# Altium schematic sheet USBBridge.SchDoc
size A4
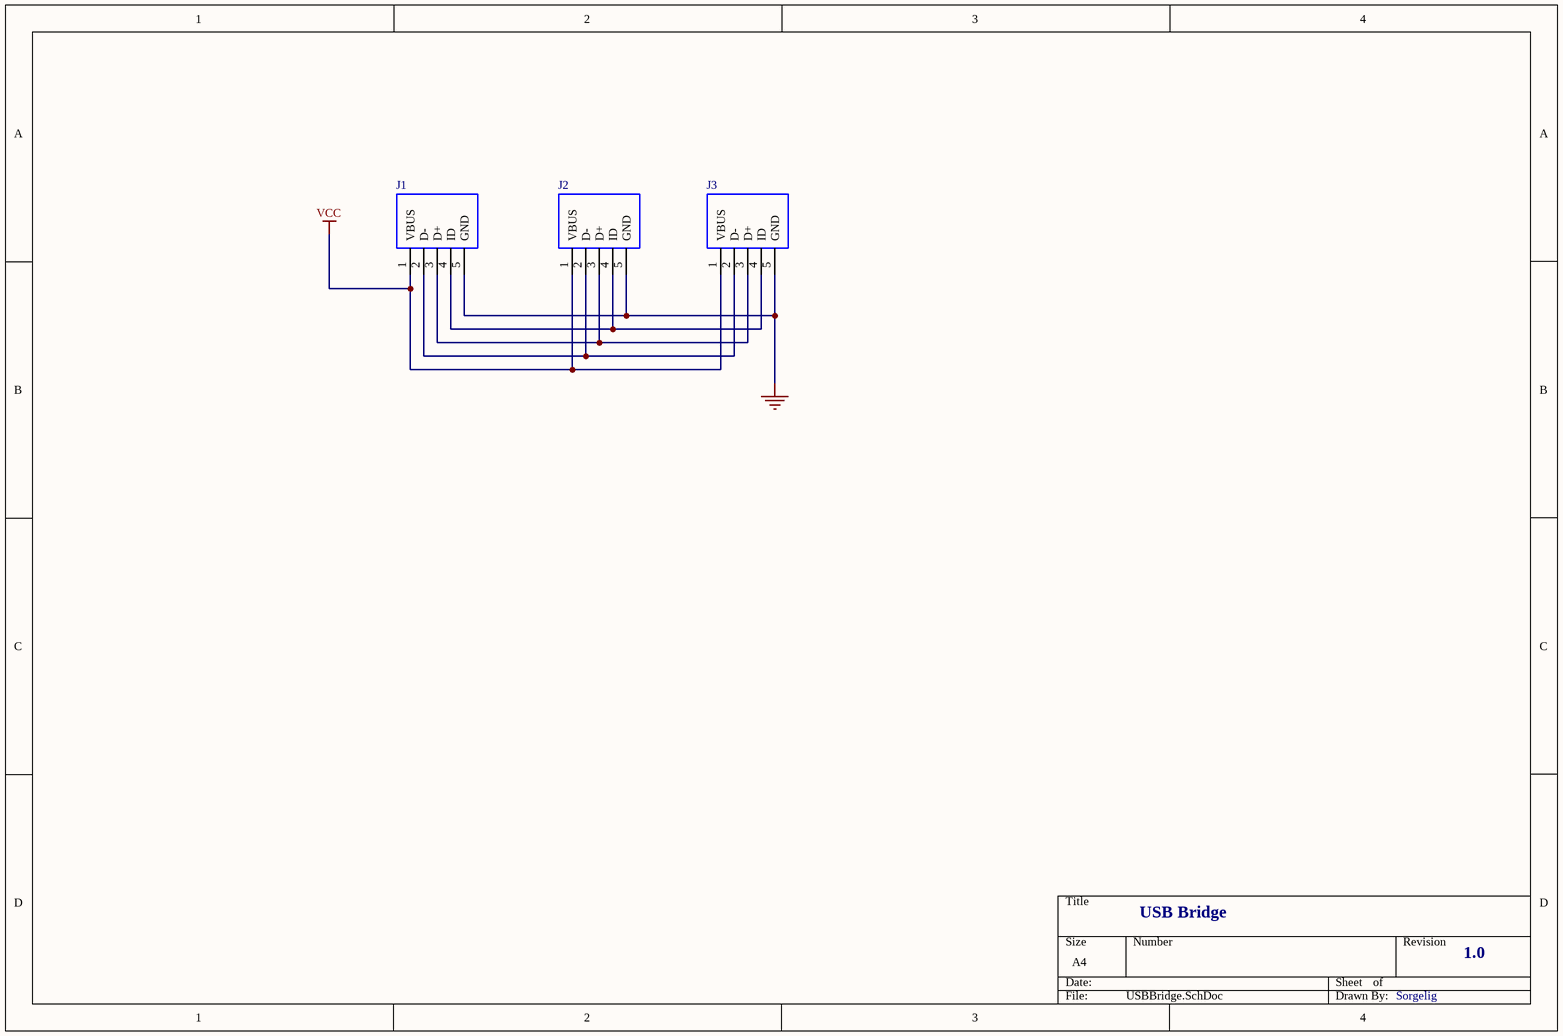
[diagram p0: USBBridge.SchDoc]

## Parts
J1  MicroUSB THT  [MicroUSB THT]  (value not drawn)
J2  MicroUSB THT  [MicroUSB THT]  (value not drawn)
J3  MicroUSB THT  [MicroUSB THT]  (value not drawn)

## Nets
GND: J1.5(GND) J2.5(GND) J3.5(GND)
VCC: J1.1(VBUS) J2.1(VBUS) J3.1(VBUS)
NetJ1_2: J1.2(D-) J2.2(D-) J3.2(D-)
NetJ1_3: J1.3(D+) J2.3(D+) J3.3(D+)
NetJ1_4: J1.4(ID) J2.4(ID) J3.4(ID)

## Notes on the sheet
- USB Bridge
- 1.0
- Sorgelig

## Library data of the parts
J1-J3 = MicroUSB THT: Manufacturer_Name: Molex; Manufacturer_Part_Number: 47346-0001; Allied_Number: 70266948; Mouser Part Number: 538-47346-0001; Mouser Price/Stock: https://www.mouser.com/Search/Refine.aspx?Keyword=538-47346-0001; RS Part Number: 7025475P; RS Price/Stock: http://uk.rs-online.com/web/p/products/7025475P; Allied Price/Stock: https://www.alliedelec.com/molex-incorporated-47346-0001/70266948/; Datasheet Link: http://www.molex.com/pdm_docs/sd/473460001_sd.pdf